# Altium schematic sheet WWJ_BIGCOINER_ES04.SchDoc
size A2
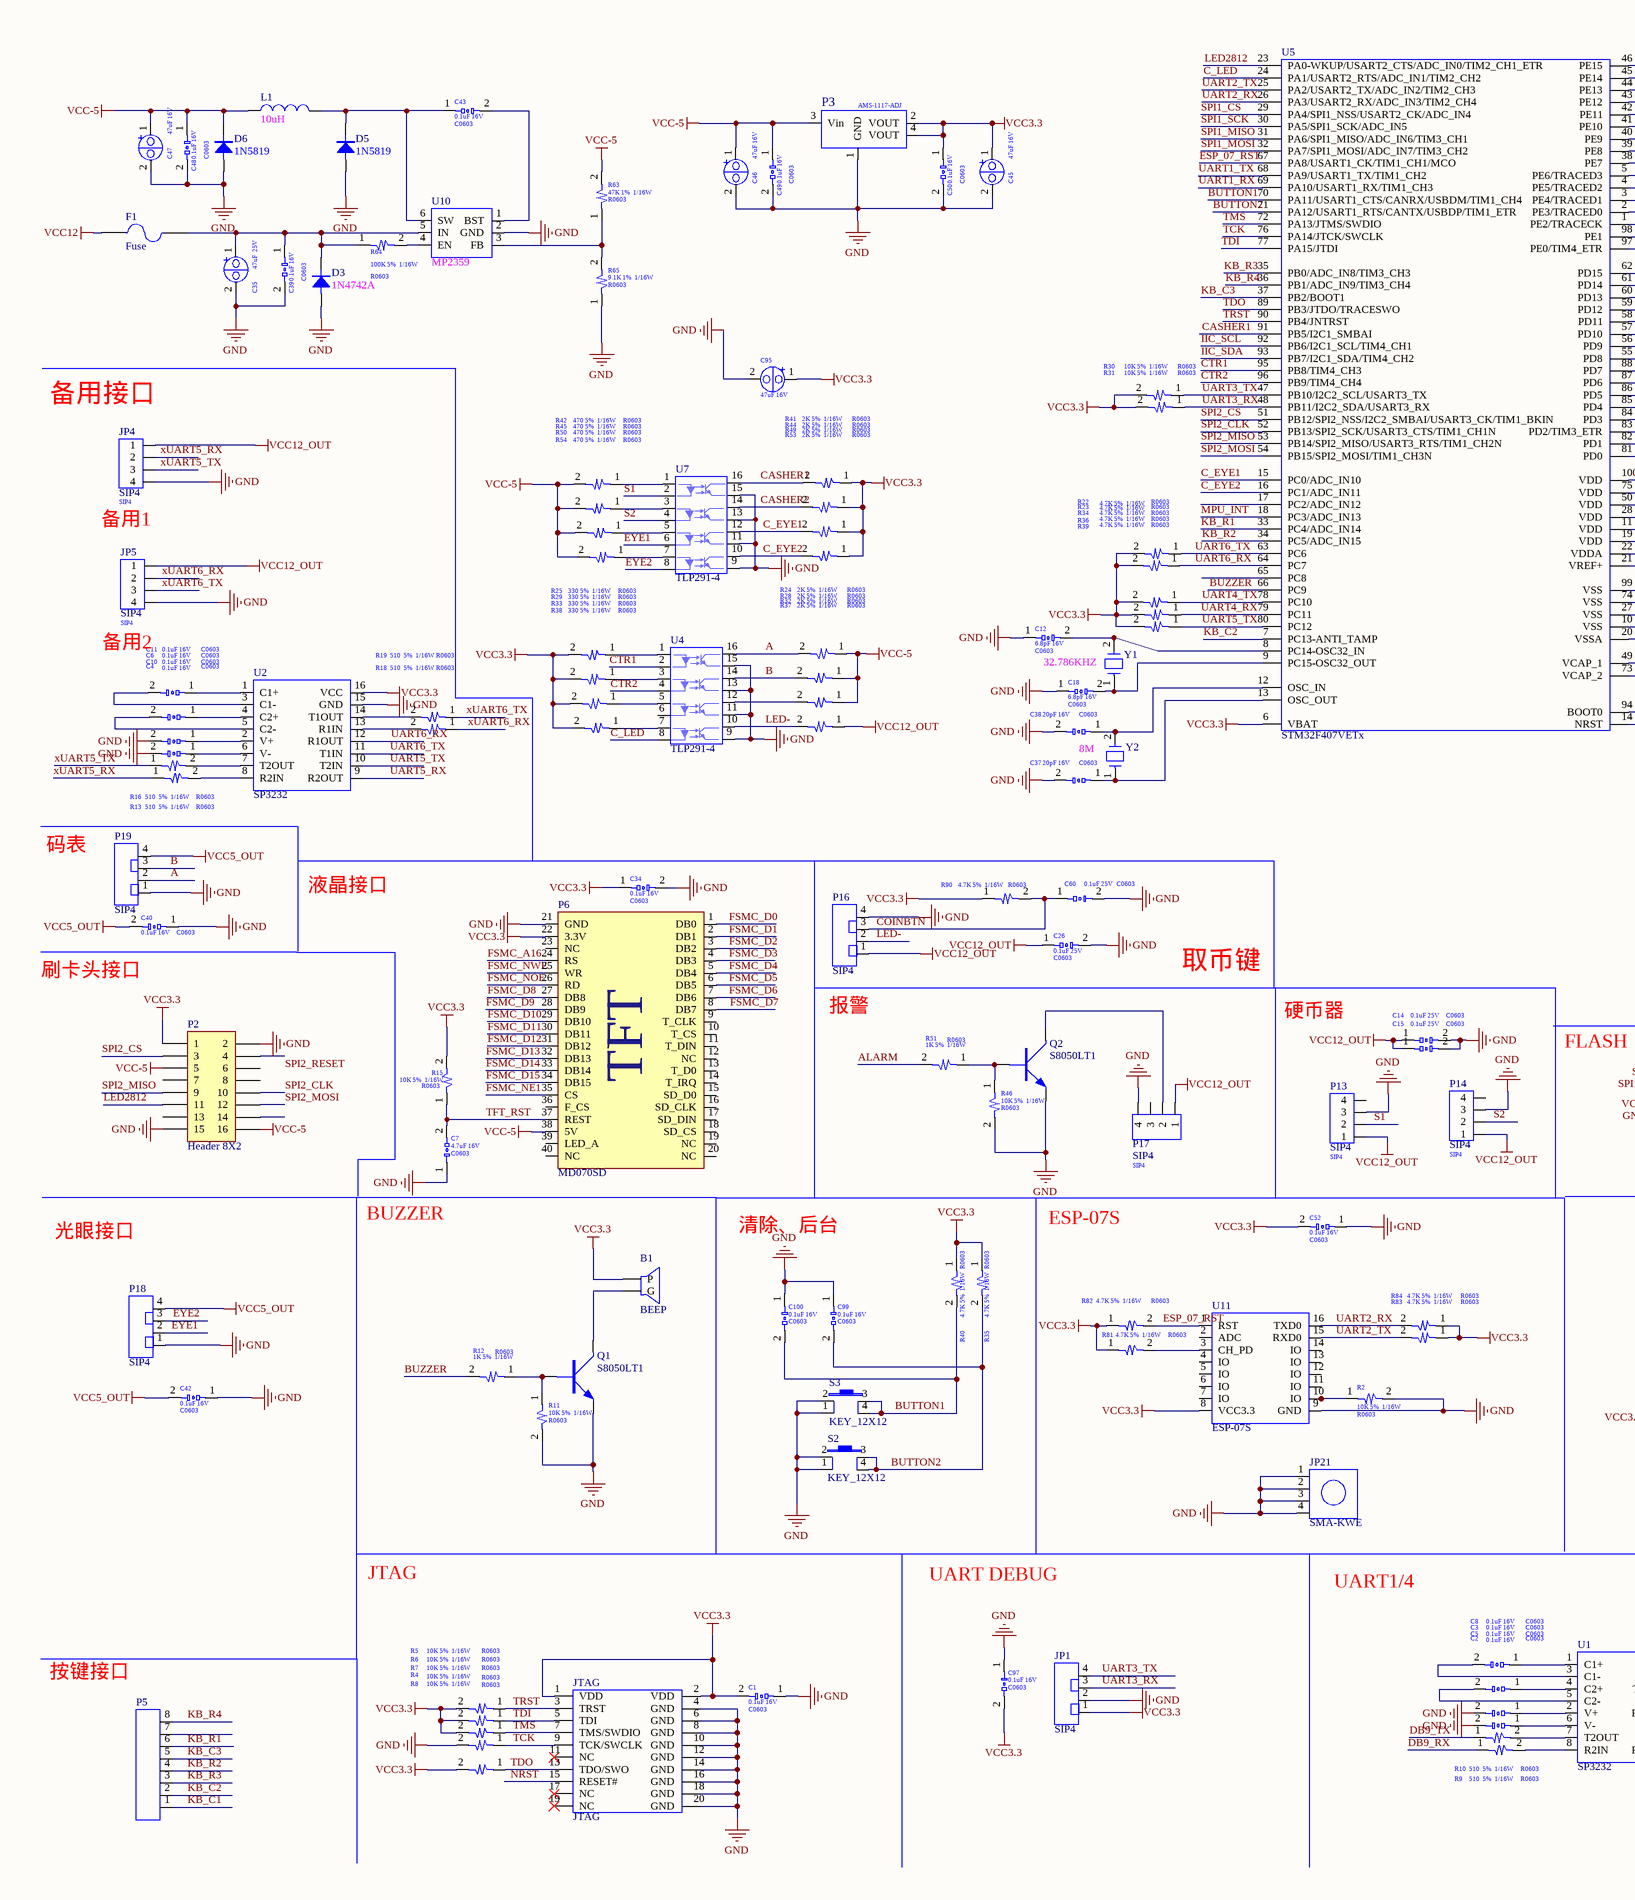
[diagram p0: WWJ_BIGCOINER_ES04.SchDoc, left]
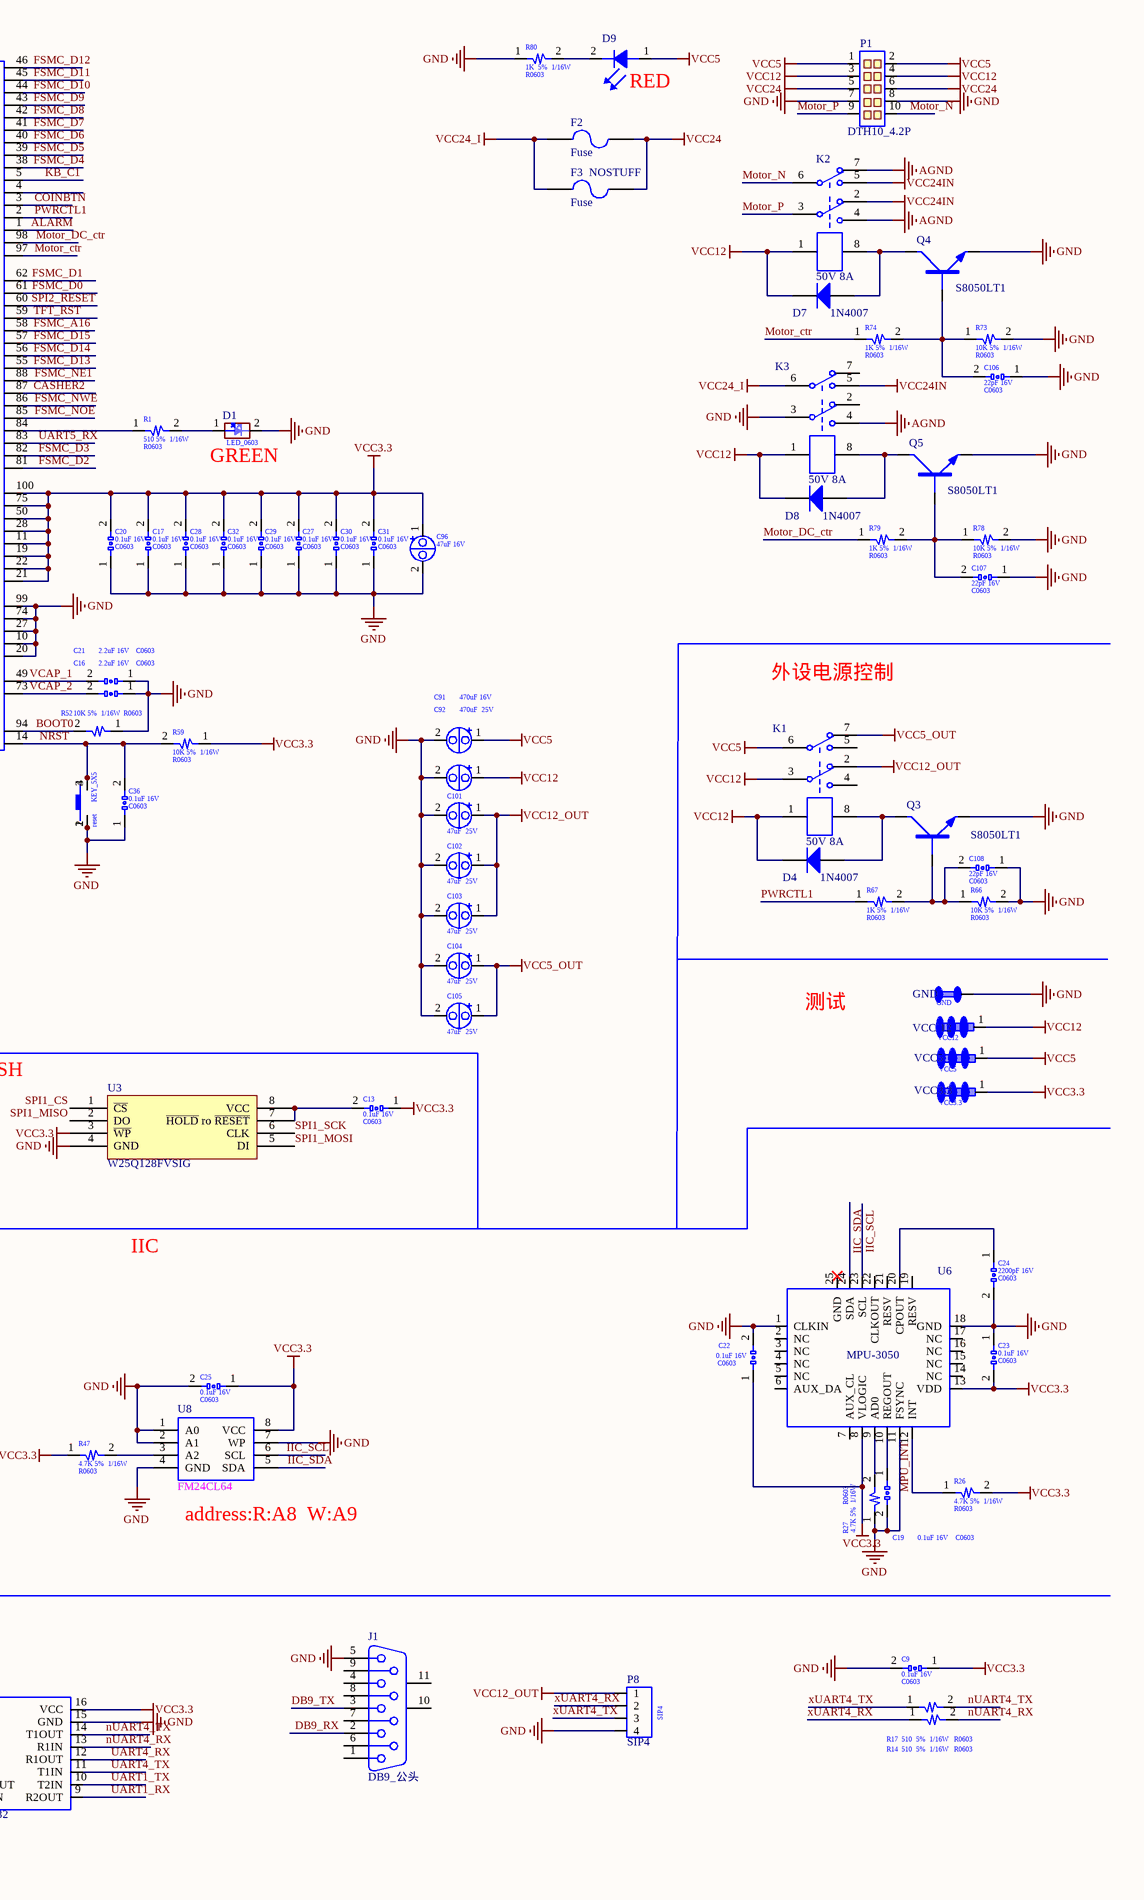
[diagram p1: WWJ_BIGCOINER_ES04.SchDoc, right]

## Parts
B1  BEEP  [BELL-5]
C1  value 0.1uF 16V  [C0603]  (hidden comment: C0603)
C2  value 0.1uF 16V  [C0603]  (hidden comment: C0603)
C3  value 0.1uF 16V  [C0603]  (hidden comment: C0603)
C4  value 0.1uF 16V  [C0603]  (hidden comment: C0603)
C5  value 0.1uF 16V  [C0603]  (hidden comment: C0603)
C6  value 0.1uF 16V  [C0603]  (hidden comment: C0603)
C7  value 4.7uF 16V  [C0603]  (hidden comment: C0603)
C8  value 0.1uF 16V  [C0603]  (hidden comment: C0603)
C9  value 0.1uF 16V  [C0603]  (hidden comment: C0603)
C10  value 0.1uF 16V  [C0603]  (hidden comment: C0603)
C11  value 0.1uF 16V  [C0603]  (hidden comment: C0603)
C12  value 6.8pF 16V  [C0603]  (hidden comment: C0603)
C13  value 0.1uF 16V  [C0603]  (hidden comment: C0603)
C14  value 0.1uF 25V  [C0603]  (hidden comment: C0603)
C15  value 0.1uF 25V  [C0603]  (hidden comment: C0603)
C16  value 2.2uF 16V  [C0603]  (hidden comment: C0603)
C17  value 0.1uF 16V  [C0603]  (hidden comment: C0603)
C18  value 6.8pF 16V  [C0603]  (hidden comment: C0603)
C19  value 0.1uF 16V  [C0603]  (hidden comment: C0603)
C20  value 0.1uF 16V  [C0603]  (hidden comment: C0603)
C21  value 2.2uF 16V  [C0603]  (hidden comment: C0603)
C22  value 0.1uF 16V  [C0603]  (hidden comment: C0603)
C23  value 0.1uF 16V  [C0603]  (hidden comment: C0603)
C24  value 2200pF 16V  [C0603]  (hidden comment: C0603)
C25  value 0.1uF 16V  [C0603]  (hidden comment: C0603)
C26  value 0.1uF 25V  [C0603]  (hidden comment: C0603)
C27  value 0.1uF 16V  [C0603]  (hidden comment: C0603)
C28  value 0.1uF 16V  [C0603]  (hidden comment: C0603)
C29  value 0.1uF 16V  [C0603]  (hidden comment: C0603)
C30  value 0.1uF 16V  [C0603]  (hidden comment: C0603)
C31  value 0.1uF 16V  [C0603]  (hidden comment: C0603)
C32  value 0.1uF 16V  [C0603]  (hidden comment: C0603)
C34  value 0.1uF 16V  [C0603]  (hidden comment: C0603)
C35  value 47uF  25V  [C6.3x6.3]  (hidden comment: C6.3X6.3_SMD)
C36  value 0.1uF 16V  [C0603]  (hidden comment: C0603)
C37  value 20pF 16V  [C0603]  (hidden comment: C0603)
C38  value 20pF 16V  [C0603]  (hidden comment: C0603)
C39  value 0.1uF 16V  [C0603]  (hidden comment: C0603)
C40  value 0.1uF 16V  [C0603]  (hidden comment: C0603)
C42  value 0.1uF 16V  [C0603]  (hidden comment: C0603)
C43  value 0.1uF 16V  [C0603]  (hidden comment: C0603)
C45  value 47uF 16V  [C5.3X5.3]  (hidden comment: C5.3X5.3_SMD)
C46  value 47uF 16V  [C5.3X5.3]  (hidden comment: C5.3X5.3_SMD)
C47  value 47uF 16V  [C5.3X5.3]  (hidden comment: C5.3X5.3_SMD)
C48  value 0.1uF 16V  [C0603]  (hidden comment: C0603)
C49  value 0.1uF 16V  [C0603]  (hidden comment: C0603)
C50  value 0.1uF 16V  [C0603]  (hidden comment: C0603)
C52  value 0.1uF 16V  [C0603]  (hidden comment: C0603)
C60  value 0.1uF 25V  [C0603]  (hidden comment: C0603)
C91  value 470uF 16V  [C10X10.5]  (hidden comment: C01-6_SMD)
C92  value 470uF  25V  [C10X10.5]  (hidden comment: C01-6_SMD)
C95  value 47uF 16V  [C5.3X5.3]  (hidden comment: C5.3X5.3_SMD)
C96  value 47uF 16V  [C5.3X5.3]  (hidden comment: C5.3X5.3_SMD)
C97  value 0.1uF 16V  [C0603]  (hidden comment: C0603)
C99  value 0.1uF 16V  [C0603]  (hidden comment: C0603)
C100  value 0.1uF 16V  [C0603]  (hidden comment: C0603)
C101  value 47uF  25V  [C6.3x6.3]  (hidden comment: C6.3X6.3_SMD)
C102  value 47uF  25V  [C6.3x6.3]  (hidden comment: C6.3X6.3_SMD)
C103  value 47uF  25V  [C6.3x6.3]  (hidden comment: C6.3X6.3_SMD)
C104  value 47uF  25V  [C6.3x6.3]  (hidden comment: C6.3X6.3_SMD)
C105  value 47uF  25V  [C6.3x6.3]  (hidden comment: C6.3X6.3_SMD)
C106  value 22pF 16V  [C0603]  (hidden comment: C0603)
C107  value 22pF 16V  [C0603]  (hidden comment: C0603)
C108  value 22pF 16V  [C0603]  (hidden comment: C0603)
D1  LED_0603  [LED_0603]
D3  1N4742A  [SMA]
D4  1N4007  [SMA]
D5  1N5819  [SOD123]
D6  1N5819  [SOD123]
D7  1N4007  [SMA]
D8  1N4007  [SMA]
D9  LED_DIP  [LED_0603]  (value not drawn)
F1  Fuse  [R1210]
F2  Fuse  [JK30-1000]
F3_NOSTUFF  Fuse  [1808]
GND  value GND  [GNDPIN_30]  (hidden comment: TP)
J1  DB9_公头  [DSUB1.385-2H9]
JP1  SIP4  [DHT11]
JP4  SIP4  [DT11]
JP5  SIP4  [DT11]
JP21  SMA-KWE  [MCX5.08-H5]
JTAG  JTAG  [JTAG_20]
K1  50V 8A  [JQX-115F-4]
K2  50V 8A  [JQX-115F-4]
K3  50V 8A  [JQX-115F-4]
L1  10uH  [L78X70MM_PIHD]
P1  DTH10_4.2P  [5557-10P]
P2  Header 8X2  [牛角2.0-2x8]
P3  AMS-1117-ADJ  [SOT_223]
P5  (no value)  [DT11_8]
P6  MD070SD  [MD070SD_40]
P8  SIP4  [DT11]
P13  SIP4  [DHT11]
P14  SIP4  [DHT11]
P16  SIP4  [DHT11]
P17  SIP4  [DHT11]
P18  SIP4  [DHT11]
P19  SIP4  [DHT11]
Q1  S8050LT1  [SOT-23-2]
Q2  S8050LT1  [SOT-23-2]
Q3  S8050LT1  [SOT-23-2]
Q4  S8050LT1  [SOT-23-2]
Q5  S8050LT1  [SOT-23-2]
R1  value 510 5%  1/16W  [R0603]  (hidden comment: R0603)
R2  value 10K 5%  1/16W  [R0603]  (hidden comment: R0603)
R4  value 10K 5%  1/16W  [R0603]  (hidden comment: R0603)
R5  value 10K 5%  1/16W  [R0603]  (hidden comment: R0603)
R6  value 10K 5%  1/16W  [R0603]  (hidden comment: R0603)
R7  value 10K 5%  1/16W  [R0603]  (hidden comment: R0603)
R8  value 10K 5%  1/16W  [R0603]  (hidden comment: R0603)
R9  value 510  5%  1/16W  [R0603]  (hidden comment: R0603)
R10  value 510  5%  1/16W  [R0603]  (hidden comment: R0603)
R11  value 10K 5%  1/16W  [R0603]  (hidden comment: R0603)
R12  value 1K 5%  1/16W  [R0603]  (hidden comment: R0603)
R13  value 510  5%  1/16W  [R0603]  (hidden comment: R0603)
R14  value 510  5%  1/16W  [R0603]  (hidden comment: R0603)
R15  value 10K 5%  1/16W  [R0603]  (hidden comment: R0603)
R16  value 510  5%  1/16W  [R0603]  (hidden comment: R0603)
R17  value 510  5%  1/16W  [R0603]  (hidden comment: R0603)
R18  value 510  5%  1/16W  [R0603]  (hidden comment: R0603)
R19  value 510  5%  1/16W  [R0603]  (hidden comment: R0603)
R22  value 4.7K 5%  1/16W  [R0603]  (hidden comment: R0603)
R23  value 4.7K 5%  1/16W  [R0603]  (hidden comment: R0603)
R24  value 2K 5%  1/16W  [R0603]  (hidden comment: R0603)
R25  value 330 5%  1/16W  [R0603]  (hidden comment: R0603)
R26  value 4.7K 5%  1/16W  [R0603]  (hidden comment: R0603)
R27  value 4.7K 5%  1/16W  [R0603]  (hidden comment: R0603)
R28  value 2K 5%  1/16W  [R0603]  (hidden comment: R0603)
R29  value 330 5%  1/16W  [R0603]  (hidden comment: R0603)
R30  value 10K 5%  1/16W  [R0603]  (hidden comment: R0603)
R31  value 10K 5%  1/16W  [R0603]  (hidden comment: R0603)
R32  value 2K 5%  1/16W  [R0603]  (hidden comment: R0603)
R33  value 330 5%  1/16W  [R0603]  (hidden comment: R0603)
R34  value 4.7K 5%  1/16W  [R0603]  (hidden comment: R0603)
R35  value 4.7K 5%  1/16W  [R0603]  (hidden comment: R0603)
R36  value 4.7K 5%  1/16W  [R0603]  (hidden comment: R0603)
R37  value 2K 5%  1/16W  [R0603]  (hidden comment: R0603)
R38  value 330 5%  1/16W  [R0603]  (hidden comment: R0603)
R39  value 4.7K 5%  1/16W  [R0603]  (hidden comment: R0603)
R40  value 4.7K 5%  1/16W  [R0603]  (hidden comment: R0603)
R41  value 2K 5%  1/16W  [R0603]  (hidden comment: R0603)
R42  value 470 5%  1/16W  [R0603]  (hidden comment: R0603)
R44  value 2K 5%  1/16W  [R0603]  (hidden comment: R0603)
R45  value 470 5%  1/16W  [R0603]  (hidden comment: R0603)
R46  value 10K 5%  1/16W  [R0603]  (hidden comment: R0603)
R47  value 4.7K 5%  1/16W  [R0603]  (hidden comment: R0603)
R49  value 2K 5%  1/16W  [R0603]  (hidden comment: R0603)
R50  value 470 5%  1/16W  [R0603]  (hidden comment: R0603)
R51  value 1K 5%  1/16W  [R0603]  (hidden comment: R0603)
R52  value 10K 5%  1/16W  [R0603]  (hidden comment: R0603)
R53  value 2K 5%  1/16W  [R0603]  (hidden comment: R0603)
R54  value 470 5%  1/16W  [R0603]  (hidden comment: R0603)
R59  value 10K 5%  1/16W  [R0603]  (hidden comment: R0603)
R63  value 47K 1%  1/16W  [R0603]  (hidden comment: R0603)
R64  value 100K 5%  1/16W  [R0603]  (hidden comment: R0603)
R65  value 9.1K 1%  1/16W  [R0603]  (hidden comment: R0603)
R66  value 10K 5%  1/16W  [R0603]  (hidden comment: R0603)
R67  value 1K 5%  1/16W  [R0603]  (hidden comment: R0603)
R73  value 10K 5%  1/16W  [R0603]  (hidden comment: R0603)
R74  value 1K 5%  1/16W  [R0603]  (hidden comment: R0603)
R78  value 10K 5%  1/16W  [R0603]  (hidden comment: R0603)
R79  value 1K 5%  1/16W  [R0603]  (hidden comment: R0603)
R80  value 1K  5%  1/16W  [R0603]  (hidden comment: R0603)
R81  value 4.7K 5%  1/16W  [R0603]  (hidden comment: R0603)
R82  value 4.7K 5%  1/16W  [R0603]  (hidden comment: R0603)
R83  value 4.7K 5%  1/16W  [R0603]  (hidden comment: R0603)
R84  value 4.7K 5%  1/16W  [R0603]  (hidden comment: R0603)
R90  value 4.7K 5%  1/16W  [R0603]  (hidden comment: R0603)
reset  KEY_5X5  [SW-RESET]
S2  KEY_12X12  [KEY12X12]
S3  KEY_12X12  [KEY12X12]
U1  SP3232  [SOIC16]
U2  SP3232  [SOIC16]
U3  W25Q128FVSIG  [LC-SOIC-8_208mil]
U4  TLP291-4  [SO-16]
U5  STM32F407VETx  [LQFP100]
U6  MPU-3050  [QFN50P400X400X90_HS-25N]
U7  TLP291-4  [SO-16]
U8  FM24CL64  [SO-8]
U10  MP2359  [IF8GD]
U11  ESP-07S  [ESP-07S]
VCC3.3  value VCC3.3  [TESTPIN_40]  (hidden comment: TEST40_PWR)
VCC5  value VCC5  [TESTPIN_40]  (hidden comment: TEST40_PWR)
VCC`12  value VCC12  [TESTPIN_40]  (hidden comment: TEST40_PWR)
Y1  32.786KHZ  [XTAL_3215]
Y2  8M  [XTAL_5032]

## Nets
AGND: K2.4 K2.7 K3.4
GND: C1.1 C2.2 C4.2 C5.2 C7.1 C9.2 C10.2 C12.1 C14.2 C15.2 C16.1 C17.1 C18.1 C19.2 C20.1 C21.1 C22.2 C23.1 C24.2 C25.2 C26.2 C27.1 C28.1 C29.1 C30.1 C31.1 C32.1 C34.2 C35.2 C36.1 C37.2 C38.2 C39.2 C40.1 C42.1 C45.2 C46.2 C47.2 C48.2 C49.2 C50.2 C52.1 C60.2 C91.2 C92.2 C95.2 C96.2 C97.1 C99.1 C100.1 C101.2 C102.2 C103.2 C104.2 C105.2 C106.1 C107.1 C108.1 D1.2 D3.1(A) D5.1(A) D6.1(A) GND.1 J1.5 JP1.2 JP4.4 JP5.4 JP21.1 JP21.2 JP21.3 JP21.4 JTAG.4(GND) JTAG.6(GND) JTAG.8(GND) JTAG.10(GND) JTAG.12(GND) JTAG.14(GND) JTAG.16(GND) JTAG.18(GND) JTAG.20(GND) K3.3 P1.7 P1.8 P2.2 P2.15 P3.1(GND) P6.21(GND) P8.4 P13.3 P14.3 P16.4 P17.4 P18.1 P19.1 Q1.E Q2.E Q3.E Q4.E Q5.E R2.2 R4.2 R11.2 R27.1 R46.2 R52.1 R65.1 R66.2 R73.2 R78.2 R80.1 reset.1 reset.2 S2.1 S2.2 S3.1 S3.2 U1.15(GND) U2.15(GND) U3.4(GND) U4.9 U4.11 U4.13 U4.15 U5.10(VSS) U5.20(VSSA) U5.27(VSS) U5.74(VSS) U5.99(VSS) U6.1(CLKIN) U6.11(FSYNC) U6.18(GND) U7.9 U7.11 U7.13 U7.15 U8.1(A0) U8.2(A1) U8.4(GND) U8.7(WP) U10.2(GND) U11.9(GND)
VCC3.3: B1.1(P) C1.2 C9.1 C13.1 C17.2 C20.2 C22.1 C23.2 C25.1 C27.2 C28.2 C29.2 C30.2 C31.2 C32.2 C34.1 C45.1 C50.1 C52.2 C95.1 C96.1 C97.2 JP1.1 JTAG.1(VDD) JTAG.2(VDD) P2.1 P3.2(VOUT) P3.4(VOUT) P6.22(3.3V) R5.2 R6.2 R7.2 R8.2 R15.2 R22.2 R23.2 R25.2 R26.2 R29.2 R30.2 R31.2 R33.2 R34.2 R35.1 R36.2 R38.2 R39.2 R40.1 R41.1 R44.1 R47.1 R49.1 R53.1 R59.1 R81.1 R82.1 R83.1 R84.1 R90.1 U1.16(VCC) U2.16(VCC) U3.3(~{WP}) U5.6(VBAT) U5.11(VDD) U5.19(VDD) U5.21(VREF+) U5.22(VDDA) U5.28(VDD) U5.50(VDD) U5.75(VDD) U5.100(VDD) U6.8(VLOGIC) U6.13(VDD) U8.8(VCC) U11.8(VCC3.3) VCC3.3.1
VCC5: C91.1 D9.1(A) K1.6 P1.1 P1.2 VCC5.1
VCC5_OUT: C40.2 C42.2 C104.1 C105.1 K1.7 P18.4 P19.4
VCC12: C92.1 D4.2(K) D7.2(K) D8.2(K) F1.1 K1.1 K1.3 K2.1 K3.1 P1.3 P1.4 VCC`12.1
VCC12_OUT: C14.1 C15.1 C26.1 C101.1 C102.1 C103.1 JP4.1 JP5.1 K1.2 P8.1 P13.1 P14.1 P16.1 P17.1 R37.1
VCC24: F2.2 F3_NOSTUFF.2 P1.5 P1.6
VCC24_I: F2.1 F3_NOSTUFF.1 K3.6
VCC24IN: K2.2 K2.5 K3.5
VCC-5: C46.1 C47.1 C48.1 C49.1 D6.2(K) L1.1 P2.5 P2.16 P3.3(Vin) P6.38(5V) R24.1 R28.1 R32.1 R42.2 R45.2 R50.2 R54.2 R63.2
A: P19.2 R24.2 U4.16
ALARM: R51.2 U5.1(PE2/TRACECK)
B: P19.3 R28.2 U4.14
BOOT0: R52.2 U5.94(BOOT0)
BUTTON1: C100.2 R40.2 S3.3 S3.4 U5.70(PA11/USART1_CTS/CANRX/USBDM/TIM1_CH4)
BUTTON2: C99.2 R35.2 S2.3 S2.4 U5.71(PA12/USART1_RTS/CANTX/USBDP/TIM1_ETR)
BUZZER: R12.2 U5.66(PC9)
C_EYE1: R49.2 U5.15(PC0/ADC_IN10) U7.12
C_EYE2: R53.2 U5.16(PC1/ADC_IN11) U7.10
C_LED: U4.8 U5.24(PA1/USART2_RTS/ADC_IN1/TIM2_CH2)
CASHER1: R41.2 U5.91(PB5/I2C1_SMBAI) U7.16
CASHER2: R44.2 U5.87(PD6) U7.14
COINBTN: C60.1 P16.3 R90.2 U5.3(PE4/TRACED1)
CTR1: U4.2 U5.95(PB8/TIM4_CH3)
CTR2: U4.4 U5.96(PB9/TIM4_CH4)
DB9_RX: J1.2 R9.1
DB9_TX: J1.3 R10.1
ESP_07_RST: R82.2 U5.67(PA8/USART1_CK/TIM1_CH1/MCO) U11.1(RST)
EYE1: P18.2 U7.6
EYE2: P18.3 U7.8
FSMC_A16: P6.24(RS) U5.58(PD11)
FSMC_D0: P6.1(DB0) U5.61(PD14)
FSMC_D1: P6.2(DB1) U5.62(PD15)
FSMC_D2: P6.3(DB2) U5.81(PD0)
FSMC_D3: P6.4(DB3) U5.82(PD1)
FSMC_D4: P6.5(DB4) U5.38(PE7)
FSMC_D5: P6.6(DB5) U5.39(PE8)
FSMC_D6: P6.7(DB6) U5.40(PE9)
FSMC_D7: P6.8(DB7) U5.41(PE10)
FSMC_D8: P6.27(DB8) U5.42(PE11)
FSMC_D9: P6.28(DB9) U5.43(PE12)
FSMC_D10: P6.29(DB10) U5.44(PE13)
FSMC_D11: P6.30(DB11) U5.45(PE14)
FSMC_D12: P6.31(DB12) U5.46(PE15)
FSMC_D13: P6.32(DB13) U5.55(PD8)
FSMC_D14: P6.33(DB14) U5.56(PD9)
FSMC_D15: P6.34(DB15) U5.57(PD10)
FSMC_NE1: P6.35(CS) U5.88(PD7)
FSMC_NOE: P6.26(RD) U5.85(PD4)
FSMC_NWE: P6.25(WR) U5.86(PD5)
IIC_SCL: U5.92(PB6/I2C1_SCL/TIM4_CH1) U6.23(SCL) U8.6(SCL)
IIC_SDA: U5.93(PB7/I2C1_SDA/TIM4_CH2) U6.24(SDA) U8.5(SDA)
KB_C1: P5.1 U5.5(PE6/TRACED3)
KB_C2: P5.2 U5.7(PC13-ANTI_TAMP)
KB_C3: P5.5 U5.37(PB2/BOOT1)
KB_R1: P5.6 U5.33(PC4/ADC_IN14)
KB_R2: P5.4 U5.34(PC5/ADC_IN15)
KB_R3: P5.3 U5.35(PB0/ADC_IN8/TIM3_CH3)
KB_R4: P5.8 U5.36(PB1/ADC_IN9/TIM3_CH4)
LED2812: P2.11 U5.23(PA0-WKUP/USART2_CTS/ADC_IN0/TIM2_CH1_ETR)
LED-: P16.2 R37.2 U4.10
Motor_ctr: R74.1 U5.97(PE0/TIM4_ETR)
Motor_DC_ctr: R79.1 U5.98(PE1)
Motor_N: K2.6 P1.10
Motor_P: K2.3 P1.9
MPU_INT: R26.1 U5.18(PC3/ADC_IN13) U6.12(INT)
NRST: C36.2 JTAG.15(RESET#) R59.2 reset.3 reset.4 U5.14(NRST)
nUART4_RX: R14.2 U1.13(R1IN)
nUART4_TX: R17.2 U1.14(T1OUT)
PWRCTL1: R67.1 U5.2(PE3/TRACED0)
S1: P13.2 U7.2
S2: P14.2 U7.4
SPI1_CS: U3.1(~{CS}) U5.29(PA4/SPI1_NSS/USART2_CK/ADC_IN4)
SPI1_MISO: U3.2(DO) U5.31(PA6/SPI1_MISO/ADC_IN6/TIM3_CH1)
SPI1_MOSI: U3.5(DI) U5.32(PA7/SPI1_MOSI/ADC_IN7/TIM3_CH2)
SPI1_SCK: U3.6(CLK) U5.30(PA5/SPI1_SCK/ADC_IN5)
SPI2_CLK: P2.10 U5.52(PB13/SPI2_SCK/USART3_CTS/TIM1_CH1N)
SPI2_CS: P2.3 U5.51(PB12/SPI2_NSS/I2C2_SMBAI/USART3_CK/TIM1_BKIN)
SPI2_MISO: P2.9 U5.53(PB14/SPI2_MISO/USART3_RTS/TIM1_CH2N)
SPI2_MOSI: P2.12 U5.54(PB15/SPI2_MOSI/TIM1_CH3N)
SPI2_RESET: P2.4 U5.60(PD13)
TCK: JTAG.9(TCK/SWCLK) R4.1 U5.76(PA14/JTCK/SWCLK)
TDI: JTAG.5(TDI) R6.1 U5.77(PA15/JTDI)
TDO: JTAG.13(TDO/SWO) R8.1 U5.89(PB3/JTDO/TRACESWO)
TFT_RST: C7.2 P6.37(REST) R15.1 U5.59(PD12)
TMS: JTAG.7(TMS/SWDIO) R7.1 U5.72(PA13/JTMS/SWDIO)
TRST: JTAG.3(TRST) R5.1 U5.90(PB4/JNTRST)
UART1_RX: U1.9(R2OUT) U5.69(PA10/USART1_RX/TIM1_CH3)
UART1_TX: U1.10(T2IN) U5.68(PA9/USART1_TX/TIM1_CH2)
UART2_RX: R84.2 U5.26(PA3/USART2_RX/ADC_IN3/TIM2_CH4) U11.16(TXD0)
UART2_TX: R83.2 U5.25(PA2/USART2_TX/ADC_IN2/TIM2_CH3) U11.15(RXD0)
UART3_RX: JP1.3 R31.1 U5.48(PB11/I2C2_SDA/USART3_RX)
UART3_TX: JP1.4 R30.1 U5.47(PB10/I2C2_SCL/USART3_TX)
UART4_RX: R36.1 U1.12(R1OUT) U5.79(PC11)
UART4_TX: R34.1 U1.11(T1IN) U5.78(PC10)
UART5_RX: U2.9(R2OUT) U5.83(PD2/TIM3_ETR)
UART5_TX: R39.1 U2.10(T2IN) U5.80(PC12)
UART6_RX: R23.1 U2.12(R1OUT) U5.64(PC7)
UART6_TX: R22.1 U2.11(T1IN) U5.63(PC6)
VCAP_1: C21.2 U5.49(VCAP_1)
VCAP_2: C16.2 U5.73(VCAP_2)
xUART4_RX: P8.2 R14.1
xUART4_TX: P8.3 R17.1
xUART5_RX: JP4.2 R13.1
xUART5_TX: JP4.3 R16.1
xUART6_RX: JP5.2 R18.1
xUART6_TX: JP5.3 R19.1
NetB1_2: B1.2(G) Q1.C
NetC2_1: C2.1 U1.6(V-)
NetC3_1: C3.1 U1.4(C2+)
NetC3_2: C3.2 U1.5(C2-)
NetC4_1: C4.1 U2.6(V-)
NetC5_1: C5.1 U1.2(V+)
NetC6_1: C6.1 U2.4(C2+)
NetC6_2: C6.2 U2.5(C2-)
NetC8_1: C8.1 U1.1(C1+)
NetC8_2: C8.2 U1.3(C1-)
NetC10_1: C10.1 U2.2(V+)
NetC11_1: C11.1 U2.1(C1+)
NetC11_2: C11.2 U2.3(C1-)
NetC12_2: C12.2 U5.8(PC14-OSC32_IN) Y1.2
NetC13_2: C13.2 U3.7(~{HOLD}_ro_~{RESET}) U3.8(VCC)
NetC18_2: C18.2 U5.9(PC15-OSC32_OUT) Y1.1
NetC19_1: C19.1 U6.10(REGOUT)
NetC24_1: C24.1 U6.20(CPOUT)
NetC35_1: C35.1 C39.1 D3.2(K) F1.2 R64.1 U10.5(IN)
NetC37_1: C37.1 U5.13(OSC_OUT) Y2.1
NetC38_1: C38.1 U5.12(OSC_IN) Y2.2
NetC43_1: C43.1 D5.2(K) L1.2 U10.6(SW)
NetC43_2: C43.2 U10.1(BST)
NetC106_2: C106.2 Q4.B R73.1 R74.2
NetC107_2: C107.2 Q5.B R78.1 R79.2
NetC108_2: C108.2 Q3.B R66.1 R67.2
NetD1_1: D1.1 R1.2
NetD4_1: D4.1(A) K1.8 Q3.C
NetD7_1: D7.1(A) K2.8 Q4.C
NetD8_1: D8.1(A) K3.8 Q5.C
NetD9_2: D9.2(K) R80.2
NetP17_2: P17.2 Q2.C
NetQ1_B: Q1.B R11.1 R12.1
NetQ2_B: Q2.B R46.1 R51.1
NetR1_1: R1.1 U5.84(PD3)
NetR2_1: R2.1 U11.10(IO)
NetR9_2: R9.2 U1.8(R2IN)
NetR10_2: R10.2 U1.7(T2OUT)
NetR13_2: R13.2 U2.8(R2IN)
NetR16_2: R16.2 U2.7(T2OUT)
NetR18_2: R18.2 U2.13(R1IN)
NetR19_2: R19.2 U2.14(T1OUT)
NetR25_1: R25.1 U4.1
NetR27_2: R27.2 U6.9(AD0)
NetR29_1: R29.1 U4.3
NetR32_2: R32.2 U4.12
NetR33_1: R33.1 U4.5
NetR38_1: R38.1 U4.7
NetR42_1: R42.1 U7.1
NetR45_1: R45.1 U7.3
NetR47_2: R47.2 U8.3(A2)
NetR50_1: R50.1 U7.5
NetR54_1: R54.1 U7.7
NetR63_1: R63.1 R65.2 U10.3(FB)
NetR64_2: R64.2 U10.4(EN)
NetR81_2: R81.2 U11.3(CH_PD)

Not connected (* = marked no-connect by the designer): J1 1 4 6 7 8 9 10(MH1) 11(MH2); JTAG 11(NC)* 17(NC)* 19(NC)*; K1 4 5; K3 2 7; P2 6 7 8 13 14; P5 7; P6 9(T_CLK) 10(T_CS) 11(T_DIN) 12(NC) 13(T_D0) 14(T_IRQ) 15(SD_D0) 16(SD_CLK) 17(SD_DIN) 18(SD_CS) 19(NC) 20(NC) 23(NC) 36(F_CS) 39(LED_A) 40(NC); P13 4; P14 4; P17 3; U4 6; U5 4(PE5/TRACED2) 17(PC2/ADC_IN12) 65(PC8); U6 2(NC) 3(NC) 4(NC) 5(NC) 6(AUX_DA) 7(AUX_CL) 14(NC) 15(NC) 16(NC) 17(NC) 19(RESV) 21(RESV) 22(CLKOUT) 25(GND)*; U11 2(ADC) 4(IO) 5(IO) 6(IO) 7(IO) 11(IO) 12(IO) 13(IO) 14(IO)

## Notes on the sheet
- (near D9) RED
- 备用接口
- (near D1) GREEN
- 备用1
- 备用2
- 外设电源控制
- 码表
- 液晶接口
- 刷卡头接口
- (near P16) 报警
- 取币键
- 测试
- 硬币器
- FLASH
- 光眼接口
- (near C7) BUZZER
- 清除、后台
- ESP-07S
- IIC
- (near U8) address:R:A8  W:A9
- JTAG
- UART DEBUG
- UART1/4
- 按键接口
- (in symbol SSD1963) TFT

## Library data of the parts
C1-C32 C34 C36-C40 C42 C43 C48-C50 C52 C60 C97 C99 C100 C106-C108 = C0603: CLASS: DISCRETE; Type: SMD; DEVICE: C0603; Value_1: C0603
C35 C101-C105 = C6.3X63_SMD: Type: SMD; CLASS: DISCRETE; DEVICE: C6.3X6.3_SMD
C45-C47 C95 C96 = C5.3X5.3_SMD: CLASS: DISCRETE; Type: SMD; DEVICE: C5.3X5.3_SMD
C91 C92 = C01-6_SMD: CLASS: DISCRETE; Type: SMD; DEVICE: C01-6_SMD
D1 = LED_0603: Type: SMD; DEVICE: LED_0805; CLASS: DISCRETE; Value: LED_0603
D3 D5 D6 = DIODE
D4 D7 D8 = Diode: Default Diode; Published: 8-Jun-2000; LatestRevisionDate: 17-Jul-2002; LatestRevisionNote: Re-released for DXP Platform.; PackageVersion: Sep-1996; PackageReference: SMC; Publisher: Altium Limited; PackageDescription: DO-214-AB/SMC; 2 C-Bend Leads; Body 7.9 x 5.9 mm, inc. leads (LxW); Code_JEDEC: DO-214-AB
D9 = LED_DIP: Value: DIODE
F1 F2 F3_NOSTUFF = Fuse 2: Published: 8-Jun-2000; LatestRevisionDate: 17-Jul-2002; LatestRevisionNote: Re-released for DXP Platform.; PackageReference: PIN-W2/E2.8; Publisher: Altium Limited; PackageDescription: Thru-Hole; 2 Leads
GND = TP: CLASS: DISCRETE; DEVICE: GNDPIN_30; Type: DIP
J1 = D Connector 9: Receptacle Assembly, 9 Position, Right Angle; PackageDocument: O; Positions: 9; Published: 15-Jun-2001; LatestRevisionDate: 17-Jul-2002; LatestRevisionNote: Re-released for DXP Platform.; DatasheetDocument: 1-Sep-1999; PackageReference: 788750; Publisher: Altium Limited; Orientation: Right Angle; Gender: Receptacle
JP1 P16 P18 P19 = SIP_4_D
K1-K3 = Relay-JQX-115F-4: Dual-Pole Dual-Throw Relay; LatestRevisionDate: JQX-115F-4; PackageReference: DIP-P8; PackageDescription: Relay; 8 Leads
L1 = INDUCTOR
P1 = JP_10PIN
P2 = Header 8X2: Header, 8-Pin, Dual row; LatestRevisionDate: 17-Jul-2002; LatestRevisionNote: Re-released for DXP Platform.; Publisher: Altium Limited
P3 = AS-1117-3.3V: Value: AMS-1117-ADJ
P5 = JP8
P6 = SSD1963
Q1-Q5 = NPN
R1 R2 R4-R19 R22-R42 R44-R47 R49-R54 R59 R63-R67 R73 R74 R78-R84 R90 = R0603: CLASS: DISCRETE; DEVICE: R0603; Type: SMD; Value_1: R0603
U3 = W25Q128FVSIG: Flash ROM; ComponentLink1Description: 供应商链接; ComponentLink1URL: http://www.szlcsc.com/product/details_36072.html; Package: SOIC-8; Supplier: LC; SuppliersPartNumber: C35101
U6 = MPU-3050A
U10 = IF8GD
VCC3.3 VCC5 VCC`12 = TESTPIN_40_PWR: CLASS: DISCRETE; DEVICE: TESTPIN_40; Type: DIP
Y1 Y2 = XTAL: Crystal
JP4 JP5 P8 P13 P14 P17 = SIP4: Value: SIP4